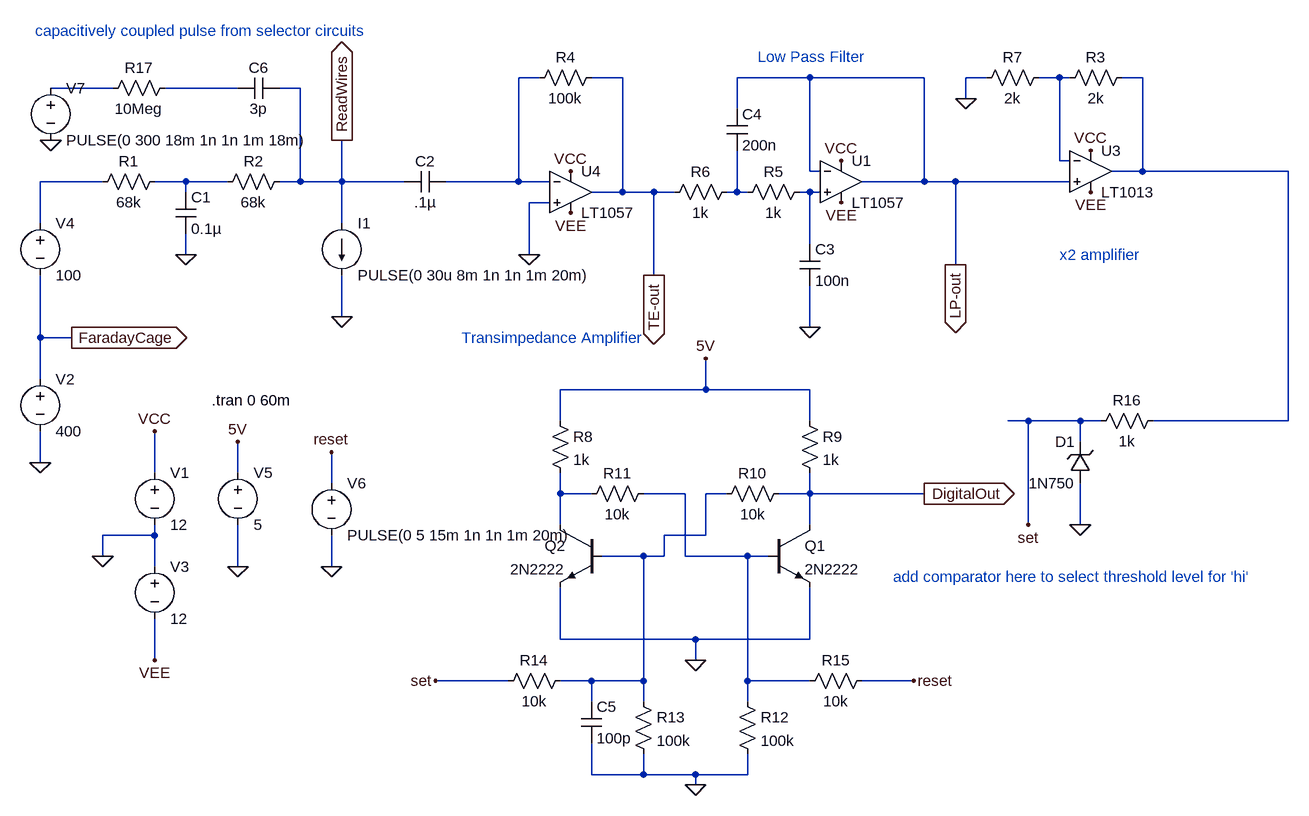
[diagram p0: schematic ReadDetectorSolidState.asc]
ReadDetectorSolidState.asc, the LTspice schematic file:
Version 4
SHEET 1 3636 1440
WIRE 560 176 528 176
WIRE 688 176 640 176
WIRE 976 176 864 176
WIRE 1152 176 976 176
WIRE 1248 176 1216 176
WIRE 1360 176 1328 176
WIRE 1376 176 1360 176
WIRE 1488 176 1456 176
WIRE -96 192 -192 192
WIRE 96 192 -16 192
WIRE 192 192 160 192
WIRE 1216 208 1216 176
WIRE 864 224 864 176
WIRE 1360 304 1360 176
WIRE 1376 304 1360 304
WIRE 976 320 976 176
WIRE 992 320 976 320
WIRE 1488 320 1488 176
WIRE 1488 320 1440 320
WIRE 1712 320 1488 320
WIRE -112 336 -208 336
WIRE 16 336 -32 336
WIRE 80 336 16 336
WIRE 192 336 192 192
WIRE 192 336 160 336
WIRE 256 336 256 272
WIRE 256 336 192 336
WIRE 352 336 256 336
WIRE 528 336 528 176
WIRE 528 336 416 336
WIRE 576 336 528 336
WIRE 1152 336 1152 176
WIRE 1152 336 1056 336
WIRE 1200 336 1152 336
WIRE 1376 336 1200 336
WIRE 16 352 16 336
WIRE 688 352 688 176
WIRE 688 352 640 352
WIRE 736 352 688 352
WIRE 768 352 736 352
WIRE 864 352 864 288
WIRE 864 352 848 352
WIRE 880 352 864 352
WIRE 976 352 960 352
WIRE 992 352 976 352
WIRE 576 368 544 368
WIRE -208 400 -208 336
WIRE 256 400 256 336
WIRE 976 432 976 352
WIRE 16 448 16 416
WIRE 544 448 544 368
WIRE 1200 464 1200 336
WIRE 736 480 736 352
WIRE 256 544 256 480
WIRE 976 560 976 496
WIRE -208 576 -208 480
WIRE -160 576 -208 576
WIRE -208 640 -208 576
WIRE 816 656 816 608
WIRE 816 656 592 656
WIRE 976 656 816 656
WIRE 592 704 592 656
WIRE 976 704 976 656
WIRE 1312 704 1280 704
WIRE 1392 704 1312 704
WIRE 1424 704 1392 704
WIRE 1712 704 1712 320
WIRE 1712 704 1504 704
WIRE 1392 736 1392 704
WIRE -208 768 -208 720
WIRE -32 784 -32 720
WIRE 96 784 96 736
WIRE 240 800 240 752
WIRE 592 816 592 784
WIRE 640 816 592 816
WIRE 784 816 720 816
WIRE 848 816 816 816
WIRE 976 816 976 784
WIRE 976 816 928 816
WIRE 1152 816 976 816
WIRE 592 864 592 816
WIRE 976 864 976 816
WIRE 1312 864 1312 704
WIRE 1392 864 1392 800
WIRE -32 880 -32 864
WIRE -32 880 -112 880
WIRE 816 880 816 816
WIRE 816 880 752 880
WIRE -112 912 -112 880
WIRE 720 912 656 912
WIRE 752 912 752 880
WIRE 752 912 720 912
WIRE 784 912 784 816
WIRE 880 912 784 912
WIRE 912 912 880 912
WIRE -32 928 -32 880
WIRE 96 928 96 864
WIRE 240 928 240 880
WIRE 592 1040 592 960
WIRE 800 1040 592 1040
WIRE 976 1040 976 960
WIRE 976 1040 800 1040
WIRE -32 1072 -32 1008
WIRE 800 1072 800 1040
WIRE 512 1104 400 1104
WIRE 640 1104 592 1104
WIRE 720 1104 720 912
WIRE 720 1104 640 1104
WIRE 880 1104 880 912
WIRE 976 1104 880 1104
WIRE 1136 1104 1056 1104
WIRE 640 1136 640 1104
WIRE 720 1136 720 1104
WIRE 880 1136 880 1104
WIRE 640 1248 640 1200
WIRE 720 1248 720 1216
WIRE 720 1248 640 1248
WIRE 800 1248 720 1248
WIRE 880 1248 880 1216
WIRE 880 1248 800 1248
WIRE 800 1264 800 1248
FLAG -208 768 0
FLAG 16 448 0
FLAG -32 720 VCC
FLAG -32 1072 VEE
FLAG -112 912 0
FLAG 544 448 0
FLAG 608 320 VCC
FLAG 608 384 VEE
FLAG 256 272 ReadWires
IOPIN 256 272 Out
FLAG -160 576 FaradayCage
IOPIN -160 576 Out
FLAG 256 544 0
FLAG 1024 304 VCC
FLAG 1024 368 VEE
FLAG 976 560 0
FLAG 1408 288 VCC
FLAG 1408 352 VEE
FLAG 1216 208 0
FLAG 736 480 TE-out
IOPIN 736 480 Out
FLAG 1200 464 LP-out
IOPIN 1200 464 Out
FLAG 1392 864 0
FLAG 800 1072 0
FLAG 800 1264 0
FLAG 816 608 5V
FLAG 1136 1104 reset
FLAG 400 1104 set
FLAG 96 928 0
FLAG 96 736 5V
FLAG 1312 864 set
FLAG 240 928 0
FLAG 240 752 reset
FLAG 1152 816 DigitalOut
IOPIN 1152 816 Out
FLAG -192 272 0
SYMBOL voltage -208 624 R0
SYMATTR InstName V2
SYMATTR Value 400
SYMBOL res -16 320 R90
WINDOW 0 0 56 VBottom 2
WINDOW 3 32 56 VTop 2
SYMATTR InstName R1
SYMATTR Value 68k
SYMBOL res 176 320 R90
WINDOW 0 0 56 VBottom 2
WINDOW 3 32 56 VTop 2
SYMATTR InstName R2
SYMATTR Value 68k
SYMBOL cap 0 352 R0
SYMATTR InstName C1
SYMATTR Value 0.1µ
SYMBOL cap 416 320 R90
WINDOW 0 0 32 VBottom 2
WINDOW 3 32 32 VTop 2
SYMATTR InstName C2
SYMATTR Value .1µ
SYMBOL voltage -32 768 R0
SYMATTR InstName V1
SYMATTR Value 12
SYMBOL voltage -32 912 R0
SYMATTR InstName V3
SYMATTR Value 12
SYMBOL voltage -208 384 R0
SYMATTR InstName V4
SYMATTR Value 100
SYMBOL res 656 160 R90
WINDOW 0 0 56 VBottom 2
WINDOW 3 32 56 VTop 2
SYMATTR InstName R4
SYMATTR Value 100k
SYMBOL Cap 960 432 R0
SYMATTR InstName C3
SYMATTR Value 100n
SYMBOL Cap 848 224 R0
SYMATTR InstName C4
SYMATTR Value 200n
SYMBOL res 976 336 R90
WINDOW 0 0 56 VBottom 2
WINDOW 3 32 56 VTop 2
SYMATTR InstName R5
SYMATTR Value 1k
SYMBOL res 864 336 R90
WINDOW 0 0 56 VBottom 2
WINDOW 3 32 56 VTop 2
SYMATTR InstName R6
SYMATTR Value 1k
SYMBOL current 256 400 R0
SYMATTR InstName I1
SYMATTR Value PULSE(0 30u 8m 1n 1n 1m 20m)
SYMATTR Value2 AC 1
SYMBOL res 1472 160 R90
WINDOW 0 0 56 VBottom 2
WINDOW 3 32 56 VTop 2
SYMATTR InstName R3
SYMATTR Value 2k
SYMBOL res 1344 160 R90
WINDOW 0 0 56 VBottom 2
WINDOW 3 32 56 VTop 2
SYMATTR InstName R7
SYMATTR Value 2k
SYMBOL zener 1408 800 R180
WINDOW 0 24 64 Left 2
WINDOW 3 24 0 Left 2
SYMATTR InstName D1
SYMATTR Value 1N750
SYMATTR Description Diode
SYMATTR Type diode
SYMBOL OpAmps/LT1057 608 288 R0
SYMATTR InstName U4
SYMBOL OpAmps/LT1057 1024 272 R0
SYMATTR InstName U1
SYMBOL OpAmps/LT1013 1408 256 R0
SYMATTR InstName U3
SYMBOL npn 912 864 R0
SYMATTR InstName Q1
SYMATTR Value 2N2222
SYMBOL npn 656 864 M0
SYMATTR InstName Q2
SYMATTR Value 2N2222
SYMBOL res 576 688 R0
SYMATTR InstName R8
SYMATTR Value 1k
SYMBOL res 960 688 R0
SYMATTR InstName R9
SYMATTR Value 1k
SYMBOL res 944 800 R90
WINDOW 0 0 56 VBottom 2
WINDOW 3 32 56 VTop 2
SYMATTR InstName R10
SYMATTR Value 10k
SYMBOL res 736 800 R90
WINDOW 0 0 56 VBottom 2
WINDOW 3 32 56 VTop 2
SYMATTR InstName R11
SYMATTR Value 10k
SYMBOL res 864 1120 R0
SYMATTR InstName R12
SYMATTR Value 100k
SYMBOL res 704 1120 R0
SYMATTR InstName R13
SYMATTR Value 100k
SYMBOL res 608 1088 R90
WINDOW 0 0 56 VBottom 2
WINDOW 3 32 56 VTop 2
SYMATTR InstName R14
SYMATTR Value 10k
SYMBOL res 1072 1088 R90
WINDOW 0 0 56 VBottom 2
WINDOW 3 32 56 VTop 2
SYMATTR InstName R15
SYMATTR Value 10k
SYMBOL voltage 96 768 R0
SYMATTR InstName V5
SYMATTR Value 5
SYMBOL voltage 240 784 R0
SYMATTR InstName V6
SYMATTR Value PULSE(0 5 15m 1n 1n 1m 20m)
SYMBOL cap 624 1136 R0
SYMATTR InstName C5
SYMATTR Value 100p
SYMBOL res 1520 688 R90
WINDOW 0 0 56 VBottom 2
WINDOW 3 32 56 VTop 2
SYMATTR InstName R16
SYMATTR Value 1k
SYMBOL cap 160 176 R90
WINDOW 0 0 32 VBottom 2
WINDOW 3 32 32 VTop 2
SYMATTR InstName C6
SYMATTR Value 3p
SYMBOL voltage -192 176 R0
SYMATTR InstName V7
SYMATTR Value PULSE(0 300 18m 1n 1n 1m 18m)
SYMBOL res 0 176 R90
WINDOW 0 0 56 VBottom 2
WINDOW 3 32 56 VTop 2
SYMATTR InstName R17
SYMATTR Value 10Meg
TEXT 56 672 Left 2 !.tran 0 60m
TEXT 896 144 Left 2 ;Low Pass Filter
TEXT 1360 448 Left 2 ;x2 amplifier
TEXT 440 576 Left 2 ;Transimpedance Amplifier
TEXT 1104 944 Left 2 ;add comparator here to select threshold level for 'hi'
TEXT -216 104 Left 2 ;capacitively coupled pulse from selector circuits

The netlist it stands for:
* ReadDetectorSolidState.asc
V2 FaradayCage 0 400
R1 N007 N006 68k
R2 ReadWires N007 68k
C1 N007 0 0.1µ
C2 N001 ReadWires .1µ
V1 VCC 0 12
V3 0 VEE 12
V4 N006 FaradayCage 100
R4 TE-out N001 100k
C3 N009 0 100n
C4 LP-out N008 200n
R5 N009 N008 1k
R6 N008 TE-out 1k
I1 ReadWires 0 PULSE(0 30u 8m 1n 1n 1m 20m) AC 1
R3 N003 N002 2k
R7 N002 0 2k
D1 0 set 1N750
XU4 0 N001 VCC VEE TE-out LT1057  ; pins In+ In- V+ V- OUT
XU1 N009 LP-out VCC VEE LP-out LT1057  ; pins In+ In- V+ V- OUT
XU3 LP-out N002 VCC VEE N003 LT1013  ; pins In+ In- V+ V- OUT
Q1 DigitalOut N011 0 0 2N2222
Q2 N010 N012 0 0 2N2222
R8 5V N010 1k
R9 5V DigitalOut 1k
R10 DigitalOut N012 10k
R11 N011 N010 10k
R12 N011 0 100k
R13 N012 0 100k
R14 N012 set 10k
R15 reset N011 10k
V5 5V 0 5
V6 reset 0 PULSE(0 5 15m 1n 1n 1m 20m)
C5 N012 0 100p
R16 N003 set 1k
C6 ReadWires N005 3p
V7 N004 0 PULSE(0 300 18m 1n 1n 1m 18m)
R17 N005 N004 10Meg
.model D D
.lib standard.dio
.model NPN NPN
.model PNP PNP
.lib standard.bjt
.tran 0 60m
* Low Pass Filter
* x2 amplifier
* Transimpedance Amplifier
* add comparator here to select threshold level for 'hi'
* capacitively coupled pulse from selector circuits
.lib LTC.lib
.backanno
.end